# EAGLE design TQFP32_DIL32_Converter (EAGLE 5.07)
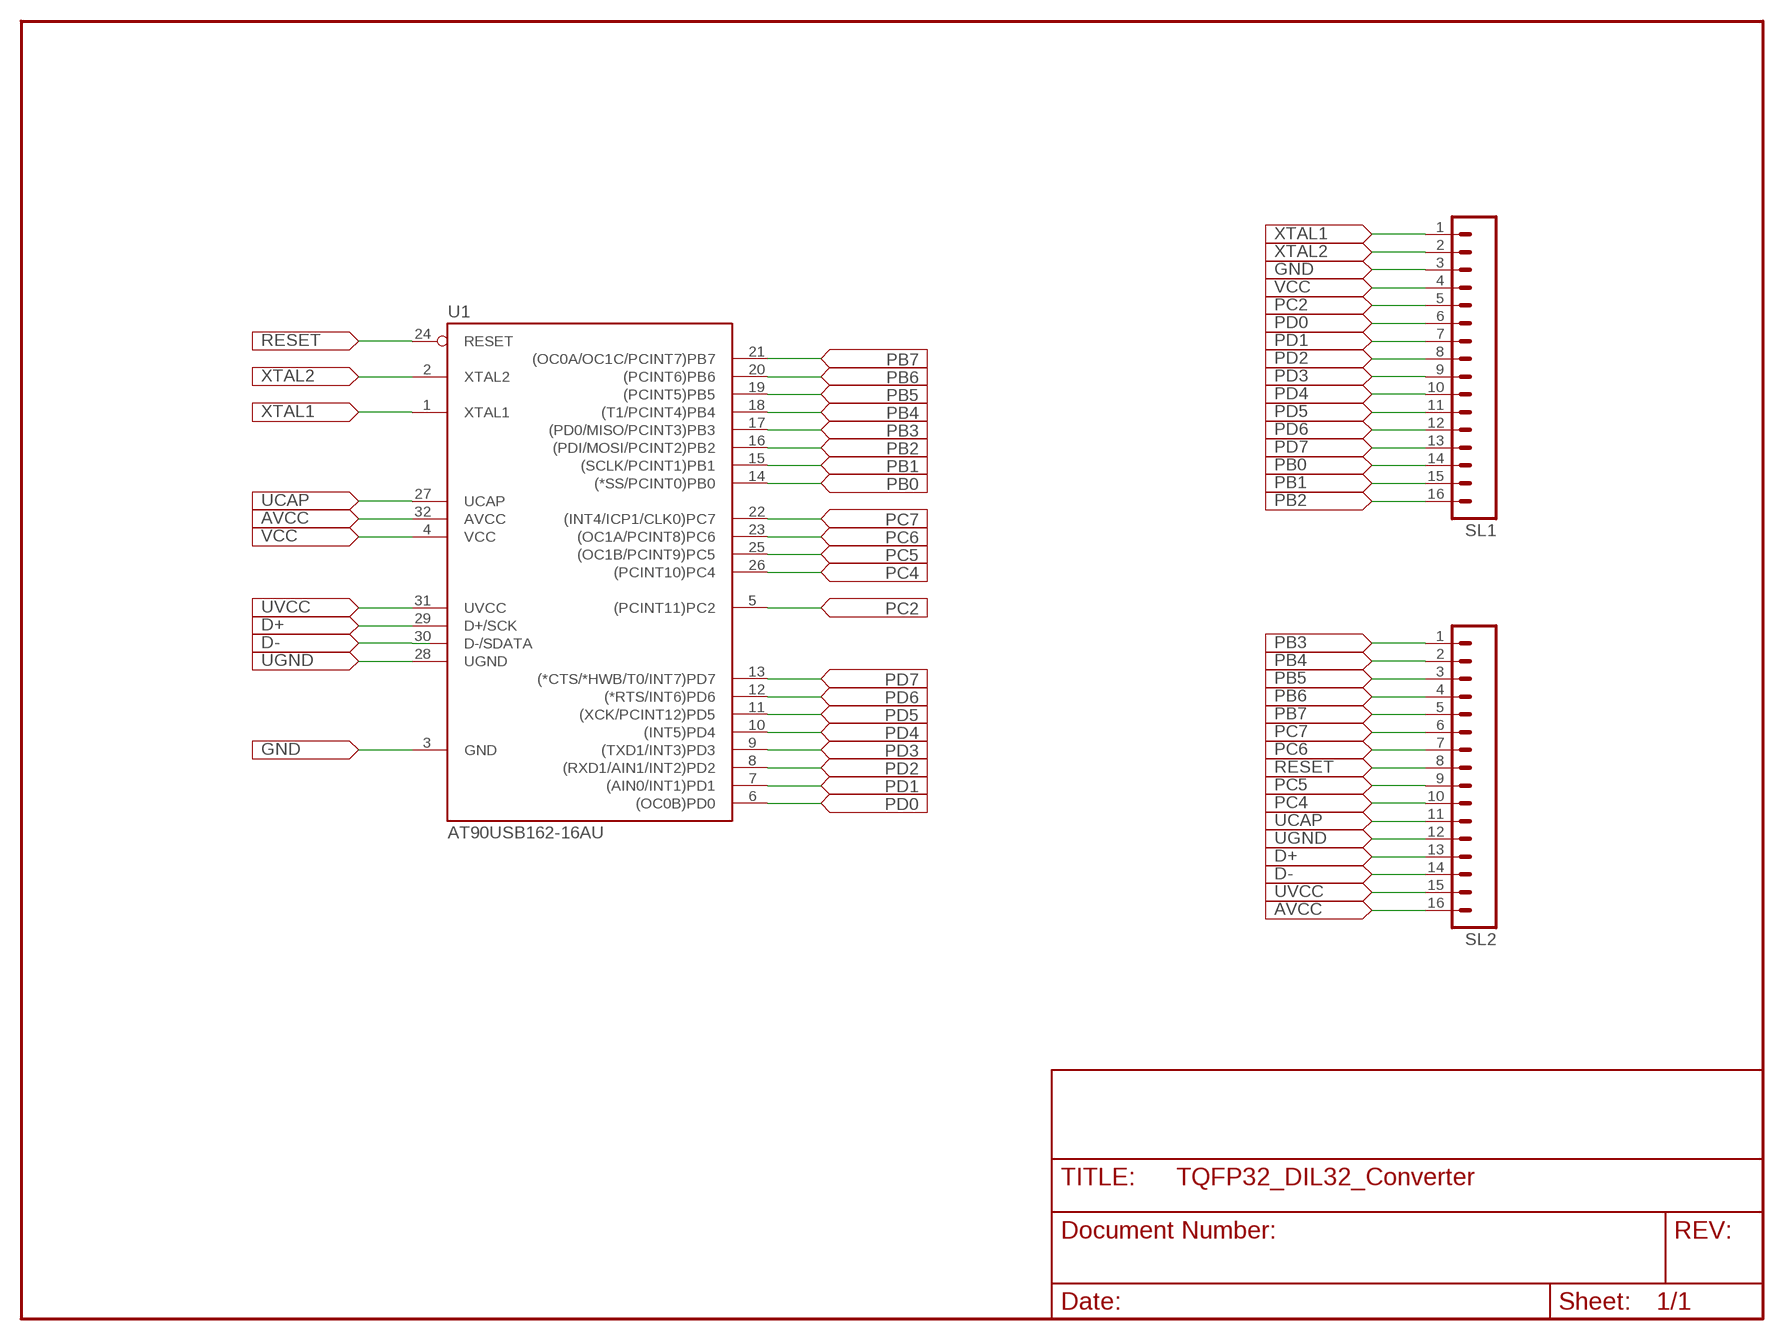
[diagram p0: schematic, sheet 1]

## Parts
SL1  M16  [16P]
SL2  M16  [16P]
U1  AT90USB162-16AU  [VQFP32]

## Nets
AVCC: SL2.16 U1.32(AVCC)
D+: SL2.13 U1.29(D+/SCK)
D-: SL2.14 U1.30(D-/SDATA)
GND: SL1.3 U1.3(GND)
PB0: SL1.14 U1.14((*SS/PCINT0)PB0)
PB1: SL1.15 U1.15((SCLK/PCINT1)PB1)
PB2: SL1.16 U1.16((PDI/MOSI/PCINT2)PB2)
PB3: SL2.1 U1.17((PD0/MISO/PCINT3)PB3)
PB4: SL2.2 U1.18((T1/PCINT4)PB4)
PB5: SL2.3 U1.19((PCINT5)PB5)
PB6: SL2.4 U1.20((PCINT6)PB6)
PB7: SL2.5 U1.21((OC0A/OC1C/PCINT7)PB7)
PC2: SL1.5 U1.5((PCINT11)PC2)
PC4: SL2.10 U1.26((PCINT10)PC4)
PC5: SL2.9 U1.25((OC1B/PCINT9)PC5)
PC6: SL2.7 U1.23((OC1A/PCINT8)PC6)
PC7: SL2.6 U1.22((INT4/ICP1/CLK0)PC7)
PD0: SL1.6 U1.6((OC0B)PD0)
PD1: SL1.7 U1.7((AIN0/INT1)PD1)
PD2: SL1.8 U1.8((RXD1/AIN1/INT2)PD2)
PD3: SL1.9 U1.9((TXD1/INT3)PD3)
PD4: SL1.10 U1.10((INT5)PD4)
PD5: SL1.11 U1.11((XCK/PCINT12)PD5)
PD6: SL1.12 U1.12((*RTS/INT6)PD6)
PD7: SL1.13 U1.13((*CTS/*HWB/T0/INT7)PD7)
RESET: SL2.8 U1.24(RESET)
UCAP: SL2.11 U1.27(UCAP)
UGND: SL2.12 U1.28(UGND)
UVCC: SL2.15 U1.31(UVCC)
VCC: SL1.4 U1.4(VCC)
XTAL1: SL1.1 U1.1(XTAL1)
XTAL2: SL1.2 U1.2(XTAL2)

## Library data of the parts
SL1 SL2 = con-amp-quick:M16: AMP QUICK CONNECTOR
U1 = at90usb:AT90USB162

## Net classes
0 default: width 0.33 mm

## Board
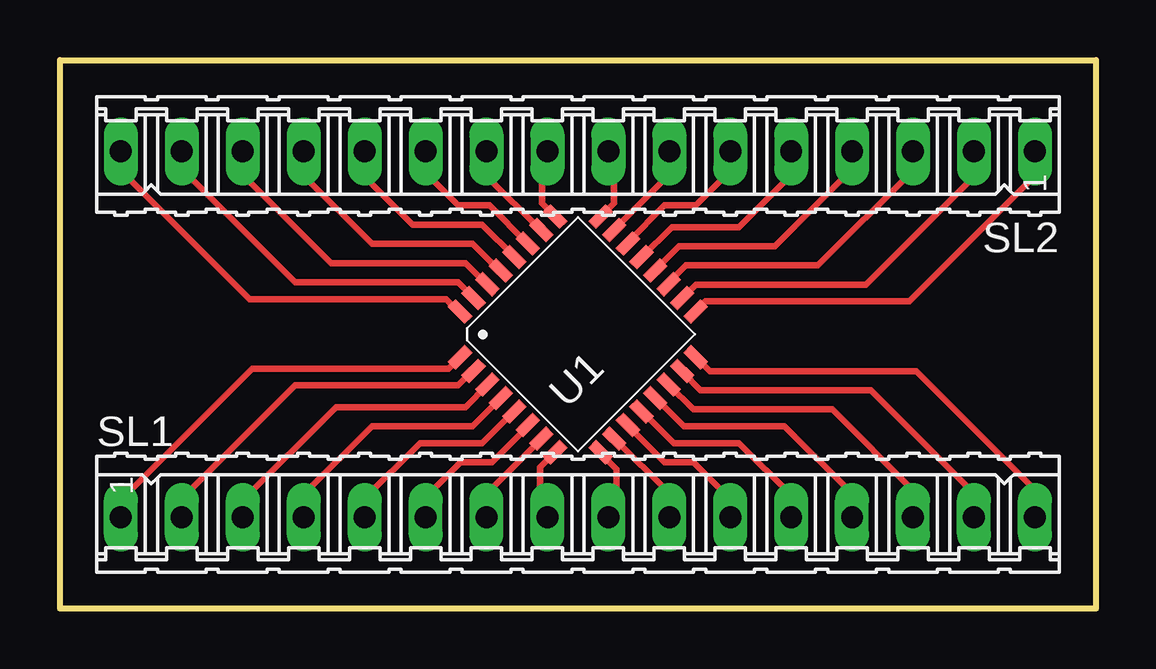
[diagram p1: board, top side]

Size 43.18 x 22.86 mm. Coordinates in mm from the lower left corner, seen from the top.
Outline: 0,0 0,22.86 43.18,22.86 43.18,0 0,0
Copper layers (1*16): Top 0.035mm / dielectric 1.5mm / Bottom 0.035mm
Design rules "default": minimum track width 10mil, minimum drill 24mil, track to track 8mil, track to pad 8mil, pad to pad 8mil, via to via 8mil, smd to smd 8mil, copper to edge 40mil, drill to drill 8mil, minimum pad ring 10mil, minimum via ring 8mil, stop-mask expansion 4mil, vias tented up to drill 0mil, thermal gap 10mil

### Footprints (pad centres in the part's own frame; a part is rotated, then mirrored left to right if it is on the bottom)
16P = drill 0.914 long: 1 -19.05,0; 2 -16.51,0; 3 -13.97,0; 4 -11.43,0; 5 -8.89,0; 6 -6.35,0; 7 -3.81,0; 8 -1.27,0; 9 1.27,0; 10 3.81,0; 11 6.35,0; 12 8.89,0; 13 11.43,0; 14 13.97,0; 15 16.51,0; 16 19.05,0
VQFP32 = smd 1 x 0.45: 1 -4.15,2.8; 2 -4.15,2; 3 -4.15,1.2; 4 -4.15,0.4; 5 -4.15,-0.4; 6 -4.15,-1.2; 7 -4.15,-2; 8 -4.15,-2.8; 17 4.15,-2.8; 18 4.15,-2; 19 4.15,-1.2; 20 4.15,-0.4; 21 4.15,0.4; 22 4.15,1.2; 23 4.15,2; 24 4.15,2.8 | smd 0.45 x 1: 9 -2.8,-4.15; 10 -2,-4.15; 11 -1.2,-4.15; 12 -0.4,-4.15; 13 0.4,-4.15; 14 1.2,-4.15; 15 2,-4.15; 16 2.8,-4.15; 25 2.8,4.15; 26 2,4.15; 27 1.2,4.15; 28 0.4,4.15; 29 -0.4,4.15; 30 -1.2,4.15; 31 -2,4.15; 32 -2.8,4.15

### Placement (x,y rotation side)
SL1  21.59,3.81 0 top
SL2  21.59,19.05 180 top
U1  21.59,11.43 45 top

### Tracks (layer width: path | path; a pad name or v marks a point on that pad's centre or on a via)
AVCC
  Top 0.28: U1.32 16.62,12.38 16.1,12.9 7.9,12.9 2.6,18.2 2.6,18.99 SL2.16
D+
  Top 0.28: U1.29 18.32,14.08 17.2,15.2 13,15.2 10.2,18 10.2,19.01 SL2.13
D-
  Top 0.28: U1.30 17.78,13.52 16.9,14.4 11.3,14.4 7.7,18 7.7,18.97 SL2.14
GND
  Top 0.28: U1.3 17.81,9.31 16.9,8.4 11.5,8.4 7.6,4.5 7.6,3.83 SL1.3
PB0
  Top 0.28: U1.14 25.37,9.33 26.4,8.3 32.2,8.3 35.6,4.9 35.6,3.85 SL1.14
PB1
  Top 0.28: U1.15 25.94,9.86 26.7,9.1 33.8,9.1 38.1,4.8 SL1.15
PB2
  Top 0.28: U1.16 26.52,10.47 27.1,9.9 35.7,9.9 40.7,4.9 40.7,3.87 SL1.16
PB3
  Top 0.28: U1.17 26.5,12.4 26.9,12.8 35.4,12.8 40.7,18.1 40.7,18.99 SL2.1
PB4
  Top 0.28: U1.18 26.5,13.5 33.6,13.5 38.1,18 SL2.2
PB5
  Top 0.28: U1.19 25.37,13.57 26.1,14.3 31.6,14.3 35.5,18.2 35.5,18.99 SL2.3
PB6
  Top 0.28: U1.20 24.81,14.11 25.8,15.1 29.8,15.1 32.9,18.2 32.9,18.93 SL2.4
PB7
  Top 0.28: U1.21 25.5,15.9 28.3,15.9 30.5,18.1 30.5,19.03 SL2.5
PC2
  Top 0.28: U1.5 18.91,8.21 17.6,6.9 15,6.9 12.7,4.6 SL1.5
PC4
  Top 0.28: U1.26 20.02,15.78 17.8,18 17.8,19.03 SL2.10
PC5
  Top 0.28: U1.25 20.64,16.36 20.1,16.9 20.1,18.83 SL2.9
PC6
  Top 0.28: U1.23 23.11,15.81 25.4,18.1 SL2.7
PC7
  Top 0.28: U1.22 23.68,15.28 25.2,16.8 26.5,16.8 27.9,18.2 27.9,19.01 SL2.6
PD0
  Top 0.28: U1.6 19.5,7.6 18,6.1 16.7,6.1 15.3,4.7 15.3,3.87 SL1.6
PD1
  Top 0.28: U1.7 17.8,4.8 17.8,3.83 SL1.7
PD2
  Top 0.28: U1.8 20.62,6.52 20,5.9 20,4.13 SL1.8
PD3
  Top 0.28: U1.9 22.54,6.46 23.2,5.8 23.2,4.15 SL1.9
PD4
  Top 0.28: U1.10 25.4,4.8 SL1.10
PD5
  Top 0.28: U1.11 23.68,7.62 25.2,6.1 26.4,6.1 27.9,4.6 27.9,3.85 SL1.11
PD6
  Top 0.28: U1.12 24.29,8.21 25.6,6.9 28.3,6.9 30.5,4.7 30.5,3.83 SL1.12
PD7
  Top 0.28: U1.13 24.82,8.78 26,7.6 30.2,7.6 33,4.8 33,3.83 SL1.13
RESET
  Top 0.28: U1.24 23.1,16.9 23.1,18.81 SL2.8
UCAP
  Top 0.28: U1.27 19.49,15.21 17.9,16.8 16.6,16.8 15.2,18.2 15.2,19.01 SL2.11
UGND
  Top 0.28: U1.28 18.94,14.66 17.6,16 14.7,16 12.7,18 SL2.12
UVCC
  Top 0.28: U1.31 16.6,13.6 9.8,13.6 5.2,18.2 5.2,18.93 SL2.15
VCC
  Top 0.28: U1.4 17.2,7.6 13,7.6 10.2,4.8 10.2,3.85 SL1.4
XTAL1
  Top 0.28: U1.1 16.2,10 8,10 2.5,4.5 2.5,3.85 SL1.1
XTAL2
  Top 0.28: U1.2 17.21,9.91 16.6,9.3 9.8,9.3 5.1,4.6 5.1,3.83 SL1.2